# Altium project MZCAT_motherboard_RPI.PrjPcb (part 2 of 2)
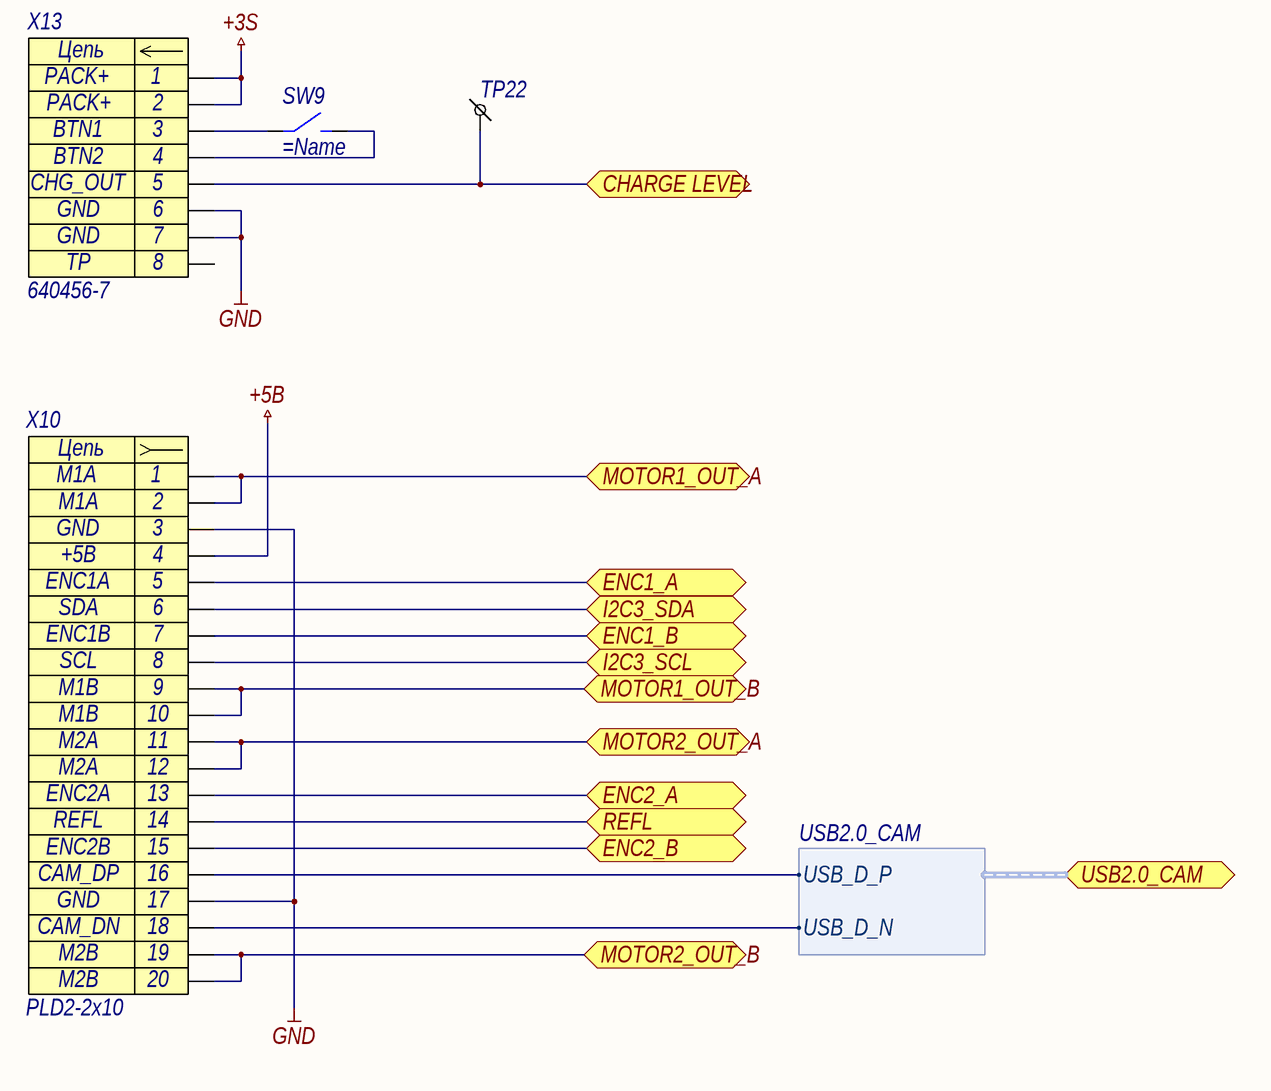
[diagram p11: MB_commutation.SchDoc, bottom right]

## Nets that join several sheets
+3,3В: MB_pwr (DD4.2 TP17.1 С19.2), MB_mcu (12 pins), MB_peripherial (15 pins)
+3S: MB_pwr (12 pins), MB_drivers (18 pins), MB_commutation (X13.1 X13.2)
+5В: MB_pwr (19 pins), MB_USB (6 pins), MB_peripherial (72 pins), MB_drivers (R50.1 R53.1 R54.1 R56.1), MB_commutation (X10.4 X11.3 X12.5)
+7,2В: MB_pwr (8 pins), MB_commutation (X11.8 X12.1 X12.2)
CM5_3,3В: MB_pwr (11 pins), MB_rpi_sys (5 pins), MB_commutation (R40.2 R43.2 X8.15 X9.15)
GND: MB_pwr (96 pins), MB_mcu (18 pins), MB_USB (18 pins), MB_rpi_sys (R5.1 VT1.2), MB_peripherial (86 pins), MB_drivers (36 pins), MB_commutation (16 pins)
CHARGE LEVEL: MB_mcu (R14.1), MB_commutation (TP22.1 X13.5)
DEBUG_SW1: MB_mcu (R18.1), MB_peripherial (SW12.2 VD12.1)
DEBUG_SW2: MB_mcu (R17.1), MB_peripherial (SW13.2 VD11.1)
DEBUG_SW3: MB_mcu (R19.3), MB_peripherial (SW14.2 VD10.1)
DEBUG_SW4: MB_mcu (R14.3), MB_peripherial (SW15.2 VD9.1)
ENC1_A: MB_mcu (R21.5), MB_commutation (X10.5)
ENC1_B: MB_mcu (R21.7), MB_commutation (X10.7)
ENC2_A: MB_mcu (R20.1), MB_commutation (X10.13)
ENC2_B: MB_mcu (R20.3), MB_commutation (X10.15)
GYRO INT: MB_mcu (R15.7), MB_peripherial (DD10.12)
I2C1_SCL: MB_mcu (DD3.45), MB_peripherial (TP29.1 X14.1)
I2C1_SDA: MB_mcu (DD3.46), MB_peripherial (TP28.1 X15.1)
I2C3_SCL: MB_mcu (R15.1), MB_peripherial (R72.1 R73.1), MB_commutation (X10.8)
I2C3_SDA: MB_mcu (R19.1), MB_peripherial (R71.1 R74.1), MB_commutation (X10.6)
LED1_DATA: MB_mcu (R19.5), MB_peripherial (HL1.1)
LED2_DATA: MB_mcu (R19.7), MB_commutation (R41.6)
LiDAR_TX: MB_rpi_sys (DD1.39), MB_commutation (R42.1 R43.1 TP23.1)
LIMIT_SW1: MB_mcu (R20.5), MB_peripherial (SW10.1 VD14.1)
LIMIT_SW2: MB_mcu (R20.7), MB_peripherial (SW11.1 VD13.1)
MOTOR1_IN_A: MB_mcu (R14.5), MB_drivers (R48.1 R62.2 TP26.1)
MOTOR1_IN_B: MB_mcu (R14.7), MB_drivers (R49.1 R60.2 TP24.1)
MOTOR1A_OUT: MB_drivers (DD8.12 DD8.13 DD8.14 DD8.15), MB_commutation (X10.1 X10.2)
MOTOR1B_OUT: MB_drivers (DD8.27 DD8.28 DD8.29 DD8.30), MB_commutation (X10.9 X10.10)
MOTOR2_IN_A: MB_mcu (R21.3), MB_drivers (R51.1 R63.2 TP27.1)
MOTOR2_IN_B: MB_mcu (R21.1), MB_drivers (R52.1 R61.2 TP25.1)
MOTOR2A_OUT: MB_drivers (DD9.12 DD9.13 DD9.14 DD9.15), MB_commutation (X10.11 X10.12)
MOTOR2B_OUT: MB_drivers (DD9.27 DD9.28 DD9.29 DD9.30), MB_commutation (X10.19 X10.20)
NetDD1_36: MB_rpi_sys (DD1.36 R8.2 TP9.1), MB_commutation (X9.13)
NetDD1_37: MB_rpi_sys (DD1.37 R7.2 TP10.1), MB_commutation (X9.14)
NetDD1_56: MB_rpi_sys (DD1.56), MB_peripherial (X15.3)
NetDD1_58: MB_rpi_sys (DD1.58), MB_peripherial (X14.3)
NetDD1_80: MB_rpi_sys (DD1.80 TP7.1), MB_commutation (X8.13)
NetDD1_82: MB_rpi_sys (DD1.82 TP8.1), MB_commutation (X8.14)
NetDD1_97: MB_rpi_sys (DD1.97 TP5.1), MB_commutation (X8.11)
NetDD1_100: MB_rpi_sys (DD1.100 TP6.1), MB_commutation (X8.12)
NetDD1_115: MB_rpi_sys (DD1.115), MB_commutation (X8.2)
NetDD1_117: MB_rpi_sys (DD1.117), MB_commutation (X8.3)
NetDD1_121: MB_rpi_sys (DD1.121), MB_commutation (X8.5)
NetDD1_123: MB_rpi_sys (DD1.123), MB_commutation (X8.6)
NetDD1_127: MB_rpi_sys (DD1.127), MB_commutation (X8.8)
NetDD1_129: MB_rpi_sys (DD1.129), MB_commutation (X8.9)
NetDD1_134: MB_USB (DD1.134), MB_commutation (X10.16)
NetDD1_136: MB_USB (DD1.136), MB_commutation (X10.18)
NetDD1_175: MB_rpi_sys (DD1.175), MB_commutation (X9.2)
NetDD1_177: MB_rpi_sys (DD1.177), MB_commutation (X9.3)
NetDD1_181: MB_rpi_sys (DD1.181), MB_commutation (X9.5)
NetDD1_183: MB_rpi_sys (DD1.183), MB_commutation (X9.6)
NetDD1_187: MB_rpi_sys (DD1.187), MB_commutation (X9.8)
NetDD1_189: MB_rpi_sys (DD1.189), MB_commutation (X9.9)
NetR1_1: MB_mcu (R15.3), MB_rpi_sys (R1.1)
NetR2_1: MB_mcu (R15.5), MB_rpi_sys (R2.1)
NetR13_3: MB_mcu (R13.3), MB_commutation (X12.3)
NetR13_5: MB_mcu (R13.5), MB_commutation (X12.4)
NetR41_2: MB_USB (X2.3), MB_commutation (R41.2)
NetR41_4: MB_USB (X3.3), MB_commutation (R41.4)
REFL: MB_mcu (R13.7), MB_commutation (X10.14)
SERVO_VYD: MB_mcu (R13.1), MB_commutation (R41.8)
STM32_RESET: MB_mcu (DD3.7 R12.2), MB_rpi_sys (R6.1)